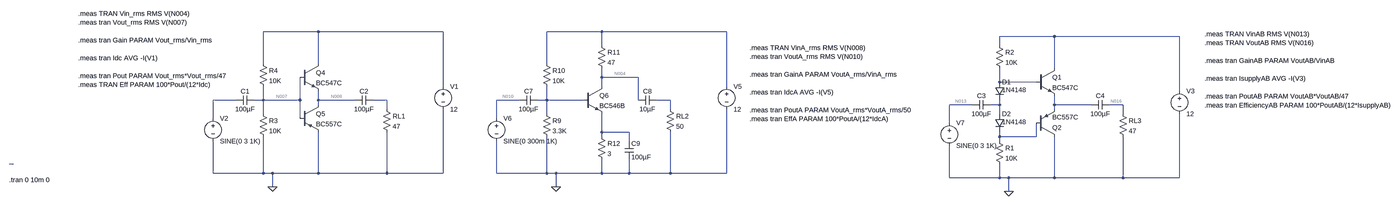
[diagram p0: schematic AUDIO_AMPLIFIER.asc, whole sheet]
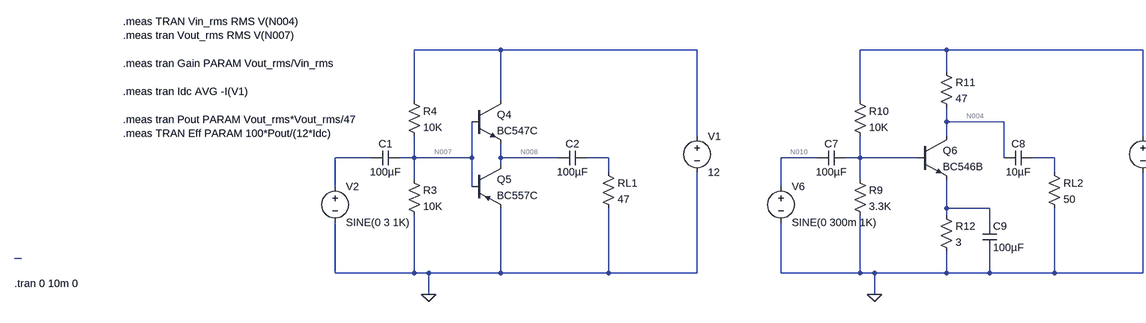
[diagram p1: schematic AUDIO_AMPLIFIER.asc, part, row 1 of 1, column 1 of 2]
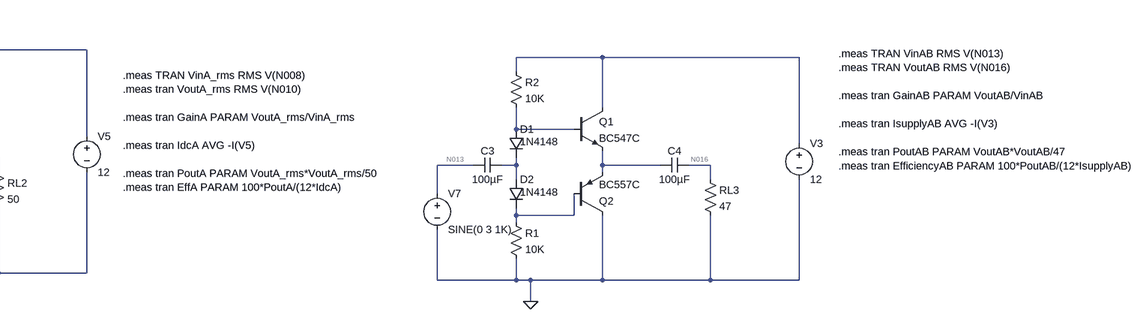
[diagram p2: schematic AUDIO_AMPLIFIER.asc, part, row 1 of 1, column 2 of 2]
AUDIO_AMPLIFIER.asc, the LTspice schematic file:
Version 4.1
SHEET 1 2732 1032
WIRE -3888 400 -4080 400
WIRE -3376 400 -3888 400
WIRE -2448 400 -2640 400
WIRE -1936 400 -2448 400
WIRE -224 416 -416 416
WIRE 288 416 -224 416
WIRE -2448 448 -2448 400
WIRE -416 448 -416 416
WIRE -4080 512 -4080 400
WIRE -3888 512 -3888 400
WIRE -2640 512 -2640 400
WIRE -224 528 -224 416
WIRE -2448 560 -2448 528
WIRE -2320 560 -2448 560
WIRE -416 576 -416 528
WIRE -288 576 -416 576
WIRE -3376 592 -3376 400
WIRE -2448 592 -2448 560
WIRE -1936 592 -1936 400
WIRE 288 608 288 416
WIRE -4176 640 -4256 640
WIRE -4080 640 -4080 592
WIRE -4080 640 -4112 640
WIRE -3952 640 -3952 560
WIRE -3952 640 -4080 640
WIRE -3888 640 -3888 608
WIRE -3760 640 -3888 640
WIRE -3648 640 -3696 640
WIRE -2736 640 -2816 640
WIRE -2640 640 -2640 592
WIRE -2640 640 -2672 640
WIRE -2512 640 -2640 640
WIRE -2320 640 -2320 560
WIRE -2208 640 -2256 640
WIRE -3888 656 -3888 640
WIRE -512 656 -592 656
WIRE -416 656 -416 640
WIRE -416 656 -448 656
WIRE -224 656 -224 624
WIRE -96 656 -224 656
WIRE 16 656 -32 656
WIRE -3648 672 -3648 640
WIRE -2208 672 -2208 640
WIRE -224 672 -224 656
WIRE -4080 688 -4080 640
WIRE -2640 688 -2640 640
WIRE -416 688 -416 656
WIRE 16 688 16 656
WIRE -4256 704 -4256 640
WIRE -3952 704 -3952 640
WIRE -2816 704 -2816 640
WIRE -592 720 -592 656
WIRE -2448 752 -2448 688
WIRE -2352 752 -2448 752
WIRE -2448 768 -2448 752
WIRE -416 768 -416 752
WIRE -288 768 -288 720
WIRE -288 768 -416 768
WIRE -2352 784 -2352 752
WIRE -416 784 -416 768
WIRE -5200 864 -5216 864
WIRE -4256 896 -4256 784
WIRE -4080 896 -4080 768
WIRE -4080 896 -4256 896
WIRE -4048 896 -4080 896
WIRE -3888 896 -3888 752
WIRE -3888 896 -4048 896
WIRE -3648 896 -3648 752
WIRE -3648 896 -3888 896
WIRE -3376 896 -3376 672
WIRE -3376 896 -3648 896
WIRE -2816 896 -2816 784
WIRE -2640 896 -2640 768
WIRE -2640 896 -2816 896
WIRE -2608 896 -2640 896
WIRE -2448 896 -2448 848
WIRE -2448 896 -2608 896
WIRE -2352 896 -2352 848
WIRE -2352 896 -2448 896
WIRE -2208 896 -2208 752
WIRE -2208 896 -2352 896
WIRE -1936 896 -1936 672
WIRE -1936 896 -2208 896
WIRE -592 912 -592 800
WIRE -416 912 -416 864
WIRE -416 912 -592 912
WIRE -384 912 -416 912
WIRE -224 912 -224 768
WIRE -224 912 -384 912
WIRE 16 912 16 768
WIRE 16 912 -224 912
WIRE 288 912 288 688
WIRE 288 912 16 912
WIRE -4048 944 -4048 896
WIRE -2608 944 -2608 896
WIRE -384 960 -384 912
FLAG -4048 944 0
FLAG -2608 944 0
FLAG -384 960 0
SYMBOL npn -3952 512 R0
SYMATTR InstName Q4
SYMATTR Value BC547C
SYMBOL pnp -3952 656 R0
SYMATTR InstName Q5
SYMATTR Value BC557C
SYMBOL res -4096 672 R0
SYMATTR InstName R3
SYMATTR Value 10K
SYMBOL res -4096 496 R0
SYMATTR InstName R4
SYMATTR Value 10K
SYMBOL voltage -3376 576 R0
WINDOW 123 0 0 Left 0
WINDOW 39 0 0 Left 0
SYMATTR InstName V1
SYMATTR Value 12
SYMBOL cap -4112 624 R90
WINDOW 0 0 32 VBottom 2
WINDOW 3 32 32 VTop 2
SYMATTR InstName C1
SYMATTR Value 100µF
SYMBOL voltage -4256 688 R0
WINDOW 123 0 0 Left 0
WINDOW 39 0 0 Left 0
SYMATTR InstName V2
SYMATTR Value SINE(0 3 1K)
SYMBOL cap -3696 624 R90
WINDOW 0 0 32 VBottom 2
WINDOW 3 32 32 VTop 2
SYMATTR InstName C2
SYMATTR Value 100µF
SYMBOL res -3664 656 R0
SYMATTR InstName RL1
SYMATTR Value 47
SYMBOL res -2656 672 R0
SYMATTR InstName R9
SYMATTR Value 3.3K
SYMBOL res -2656 496 R0
SYMATTR InstName R10
SYMATTR Value 10K
SYMBOL voltage -1936 576 R0
WINDOW 123 0 0 Left 0
WINDOW 39 0 0 Left 0
SYMATTR InstName V5
SYMATTR Value 12
SYMBOL cap -2672 624 R90
WINDOW 0 0 32 VBottom 2
WINDOW 3 32 32 VTop 2
SYMATTR InstName C7
SYMATTR Value 100µF
SYMBOL voltage -2816 688 R0
WINDOW 123 24 124 Left 2
WINDOW 39 0 0 Left 0
SYMATTR InstName V6
SYMATTR Value SINE(0 300m 1K)
SYMBOL cap -2256 624 R90
WINDOW 0 0 32 VBottom 2
WINDOW 3 32 32 VTop 2
SYMATTR InstName C8
SYMATTR Value 10µF
SYMBOL res -2224 656 R0
SYMATTR InstName RL2
SYMATTR Value 50
SYMBOL npn -2512 592 R0
SYMATTR InstName Q6
SYMATTR Value BC546B
SYMBOL res -2464 432 R0
SYMATTR InstName R11
SYMATTR Value 47
SYMBOL res -2464 752 R0
SYMATTR InstName R12
SYMATTR Value 3
SYMBOL cap -2368 784 R0
SYMATTR InstName C9
SYMATTR Value 100µF
SYMBOL npn -288 528 R0
SYMATTR InstName Q1
SYMATTR Value BC547C
SYMBOL pnp -288 768 M180
SYMATTR InstName Q2
SYMATTR Value BC557C
SYMBOL res -432 768 R0
SYMATTR InstName R1
SYMATTR Value 10K
SYMBOL res -432 432 R0
SYMATTR InstName R2
SYMATTR Value 10K
SYMBOL voltage 288 592 R0
WINDOW 123 0 0 Left 0
WINDOW 39 0 0 Left 0
SYMATTR InstName V3
SYMATTR Value 12
SYMBOL cap -448 640 R90
WINDOW 0 0 32 VBottom 2
WINDOW 3 32 32 VTop 2
SYMATTR InstName C3
SYMATTR Value 100µF
SYMBOL cap -32 640 R90
WINDOW 0 0 32 VBottom 2
WINDOW 3 32 32 VTop 2
SYMATTR InstName C4
SYMATTR Value 100µF
SYMBOL res 0 672 R0
SYMATTR InstName RL3
SYMATTR Value 47
SYMBOL voltage -592 704 R0
WINDOW 123 0 0 Left 0
WINDOW 39 0 0 Left 0
SYMATTR InstName V7
SYMATTR Value SINE(0 3 1K)
SYMBOL diode -432 576 R0
WINDOW 3 24 28 Left 2
SYMATTR Value 1N4148
SYMATTR InstName D1
SYMBOL diode -432 688 R0
WINDOW 3 24 28 Left 2
SYMATTR Value 1N4148
SYMATTR InstName D2
TEXT -5216 920 Left 2 !.tran 0 10m 0
TEXT -4728 336 Left 2 !.meas TRAN Vin_rms RMS V(N004)\n.meas tran Vout_rms RMS V(N007)\n \n.meas tran Gain PARAM Vout_rms/Vin_rms\n \n.meas tran Idc AVG -I(V1)\n \n.meas tran Pout PARAM Vout_rms*Vout_rms/47\n.meas TRAN Eff PARAM 100*Pout/(12*Idc)
TEXT -1856 456 Left 2 !.meas TRAN VinA_rms RMS V(N008)\n.meas tran VoutA_rms RMS V(N010)\n \n.meas tran GainA PARAM VoutA_rms/VinA_rms\n \n.meas tran IdcA AVG -I(V5)\n \n.meas tran PoutA PARAM VoutA_rms*VoutA_rms/50\n.meas tran EffA PARAM 100*PoutA/(12*IdcA)
TEXT 376 408 Left 2 !.meas TRAN VinAB RMS V(N013)\n.meas TRAN VoutAB RMS V(N016)\n \n.meas tran GainAB PARAM VoutAB/VinAB\n \n.meas tran IsupplyAB AVG -I(V3)\n \n.meas tran PoutAB PARAM VoutAB*VoutAB/47\n.meas tran EfficiencyAB PARAM 100*PoutAB/(12*IsupplyAB)

The netlist it stands for:
* AUDIO_AMPLIFIER.asc
Q4 N001 N007 N008 0 BC547C
Q5 N008 N007 0 0 BC557C
R3 N007 0 10K
R4 N001 N007 10K
V1 N001 0 12
C1 N007 N006 100µF
V2 N006 0 SINE(0 3 1K)
C2 N009 N008 100µF
RL1 N009 0 47
R9 N011 0 3.3K
R10 N002 N011 10K
V5 N002 0 12
C7 N011 N010 100µF
V6 N010 0 SINE(0 300m 1K)
C8 N012 N004 10µF
RL2 N012 0 50
Q6 N004 N011 N017 0 BC546B
R11 N002 N004 47
R12 N017 0 3
C9 N017 0 100µF
Q1 N003 N005 N015 0 BC547C
Q2 0 N018 N015 0 BC557C
R1 N018 0 10K
R2 N003 N005 10K
V3 N003 0 12
C3 N014 N013 100µF
C4 N016 N015 100µF
RL3 N016 0 47
V7 N013 0 SINE(0 3 1K)
D1 N005 N014 1N4148
D2 N014 N018 1N4148
.model D D
.lib standard.dio
.model NPN NPN
.model PNP PNP
.lib standard.bjt
.tran 0 10m 0
.meas TRAN Vin_rms RMS V(N004)
.meas tran Vout_rms RMS V(N007)
.meas tran Gain PARAM Vout_rms/Vin_rms
.meas tran Idc AVG -I(V1)
.meas tran Pout PARAM Vout_rms*Vout_rms/47
.meas TRAN Eff PARAM 100*Pout/(12*Idc)
.meas TRAN VinA_rms RMS V(N008)
.meas tran VoutA_rms RMS V(N010)
.meas tran GainA PARAM VoutA_rms/VinA_rms
.meas tran IdcA AVG -I(V5)
.meas tran PoutA PARAM VoutA_rms*VoutA_rms/50
.meas tran EffA PARAM 100*PoutA/(12*IdcA)
.meas TRAN VinAB RMS V(N013)
.meas TRAN VoutAB RMS V(N016)
.meas tran GainAB PARAM VoutAB/VinAB
.meas tran IsupplyAB AVG -I(V3)
.meas tran PoutAB PARAM VoutAB*VoutAB/47
.meas tran EfficiencyAB PARAM 100*PoutAB/(12*IsupplyAB)
.backanno
.end